# Altium schematic sheet Teensy.SchDoc
size A
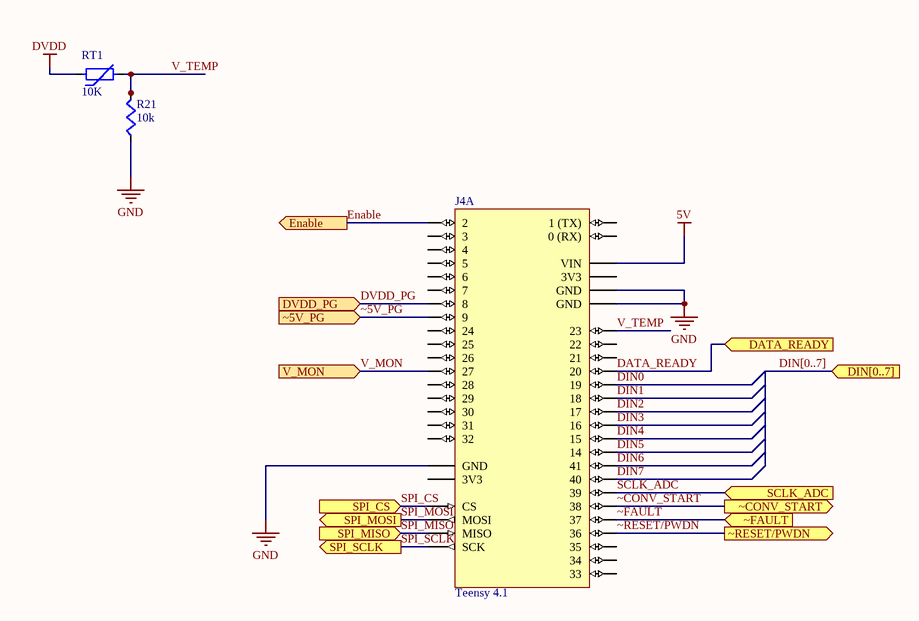
[diagram p0: Teensy.SchDoc]

## Parts
J4  Teensy 4.1  [Teensy4.1]  (part A of 2)
R21  10k  [R0603]
RT1  10K  [R0603]

## Ports
DATA_READY (in), DIN[0..7] (in), DVDD_PG (in), Enable (out), SCLK_ADC (in), SPI_CS (in), SPI_MISO (in), SPI_MOSI (out), SPI_SCLK (out), V_MON (in), ~5V_PG (in), ~CONV_START (out), ~FAULT (in), ~RESET/PWDN (out)

## Nets
5V: J4.48(VIN)
DVDD: RT1.1
GND: J4.1(GND) J4.34(GND) J4.47(GND) R21.1
DATA_READY: J4.42(20) ; port DATA_READY
DIN0: J4.41(19)
DIN1: J4.40(18)
DIN2: J4.39(17)
DIN3: J4.38(16)
DIN4: J4.37(15)
DIN5: J4.36(14)
DIN6: J4.33(41)
DIN7: J4.32(40)
DVDD_PG: J4.10(8) ; port DVDD_PG
Enable: J4.4(2) ; port Enable
SCLK_ADC: J4.31(39) ; port SCLK_ADC
SPI_CS: J4.12(CS) ; port SPI_CS
SPI_MISO: J4.14(MISO) ; port SPI_MISO
SPI_MOSI: J4.13(MOSI) ; port SPI_MOSI
SPI_SCLK: J4.35(SCK) ; port SPI_SCLK
V_MON: J4.19(27) ; port V_MON
V_TEMP: J4.45(23) R21.2 RT1.2
~5V_PG: J4.11(9) ; port ~5V_PG
~CONV_START: J4.30(38) ; port ~CONV_START
~FAULT: J4.29(37) ; port ~FAULT
~RESET/PWDN: J4.28(36) ; port ~RESET/PWDN

Not connected (* = marked no-connect by the designer): J4 2(0_(RX)) 3(1_(TX)) 5(3) 6(4) 7(5) 8(6) 9(7) 15(3V3) 16(24) 17(25) 18(26) 20(28) 21(29) 22(30) 23(31) 24(32) 25(33) 26(34) 27(35) 43(21) 44(22) 46(3V3)

## Buses and harness runs
bus DIN[0..7] = port DIN[0..7]

## Library data of the parts
J4 = Teensy4.1
R21 = RC0603JR-0710KL: RES SMD 10K OHM 5% 1/10W 0603
RT1 = ERT-J1VG103JA: Thermistor NTC 10KOhm 5% 2-Pin 0603 Punched Carrier T/R; Manufacturer 1: Panasonic; Max Power Dissipation: 100mW; Accuracy: 1%; Resistance: 10kR; Supplier 1: Digi-Key; Supplier Part Number 1: P12014CT-ND; Manufacturer Part Number 1: ERT-J1VG103JA; Stock 1: 47318; Pricing 1: 1=0.15000, 5=0.14600, 10=0.13000, 25=0.12000, 50=0.09600, 100=0.08240, 500=0.07208, 1000=0.06178 (USD); RoHS: Yes; Mount: Surface Mount; Case/Package: 0603; Number of Pins: 2; Case Code (Metric): 1608; Case Code (Imperial): 0603; Min Operating Temperature: -40°C; Max Operating Temperature: 125°C; Termination: SMD/SMT; Packaging: Tape and Reel; Tolerance: 5%; Package Quantity: 4000; Length: 1.6mm; Depth: 0.8mm; Width: 800um; Radiation Hardening: No; Lead Free: Lead Free; REACH SVHC: No SVHC; ComponentLink1URL: https://datasheet.ciiva.com/1303/1314428-1303168.pdf?src-supplier=Farnell; ComponentLink1Description: https://datasheet.ciiva.com/1303/1314428-1303168.pdf?src-supplier=Farnell; ComponentLink2URL: https://datasheet.ciiva.com/30067/aua0000ce1-30067157.pdf?src-supplier=Onlinecomponents.com; ComponentLink2Description: https://datasheet.ciiva.com/30067/aua0000ce1-30067157.pdf?src-supplier=Onlinecomponents.com; ComponentLink3URL: https://datasheet.ciiva.com/46376/1314428-46376550.pdf?src-supplier=Element14; ComponentLink3Description: https://datasheet.ciiva.com/46376/1314428-46376550.pdf?src-supplier=Element14; ComponentLink4URL: https://datasheet.ciiva.com/2848/aua0000ce1-2848556.pdf?src-supplier=Digi-Key; ComponentLink4Description: https://datasheet.ciiva.com/2848/aua0000ce1-2848556.pdf?src-supplier=Digi-Key; ComponentLink5URL: https://datasheet.ciiva.com/16394/aua0000ce1-16394028.pdf?src-supplier=Future+Electronics; ComponentLink5Description: https://datasheet.ciiva.com/16394/aua0000ce1-16394028.pdf?src-supplier=Future+Electronics; ComponentLink6URL: https://datasheet.ciiva.com/46388/1314428-46388812.pdf?src-supplier=Element14; ComponentLink6Description: https://datasheet.ciiva.com/46388/1314428-46388812.pdf?src-supplier=Element14; ComponentLink7URL: https://datasheet.ciiva.com/2848/aua0000ce1-2848557.pdf?src-supplier=Digi-Key; ComponentLink7Description: https://datasheet.ciiva.com/2848/aua0000ce1-2848557.pdf?src-supplier=Digi-Key; ComponentLink8URL: https://datasheet.ciiva.com/2848/aua0000ce1-2848558.pdf?src-supplier=Digi-Key; ComponentLink8Description: https://datasheet.ciiva.com/2848/aua0000ce1-2848558.pdf?src-supplier=Digi-Key; ComponentLink9URL: https://datasheet.ciiva.com/3280/aua0000ce1-3280462.pdf?src-supplier=Avnet; ComponentLink9Description: https://datasheet.ciiva.com/3280/aua0000ce1-3280462.pdf?src-supplier=Avnet